# Altium schematic sheet MotorDriver.SchDoc
size A3
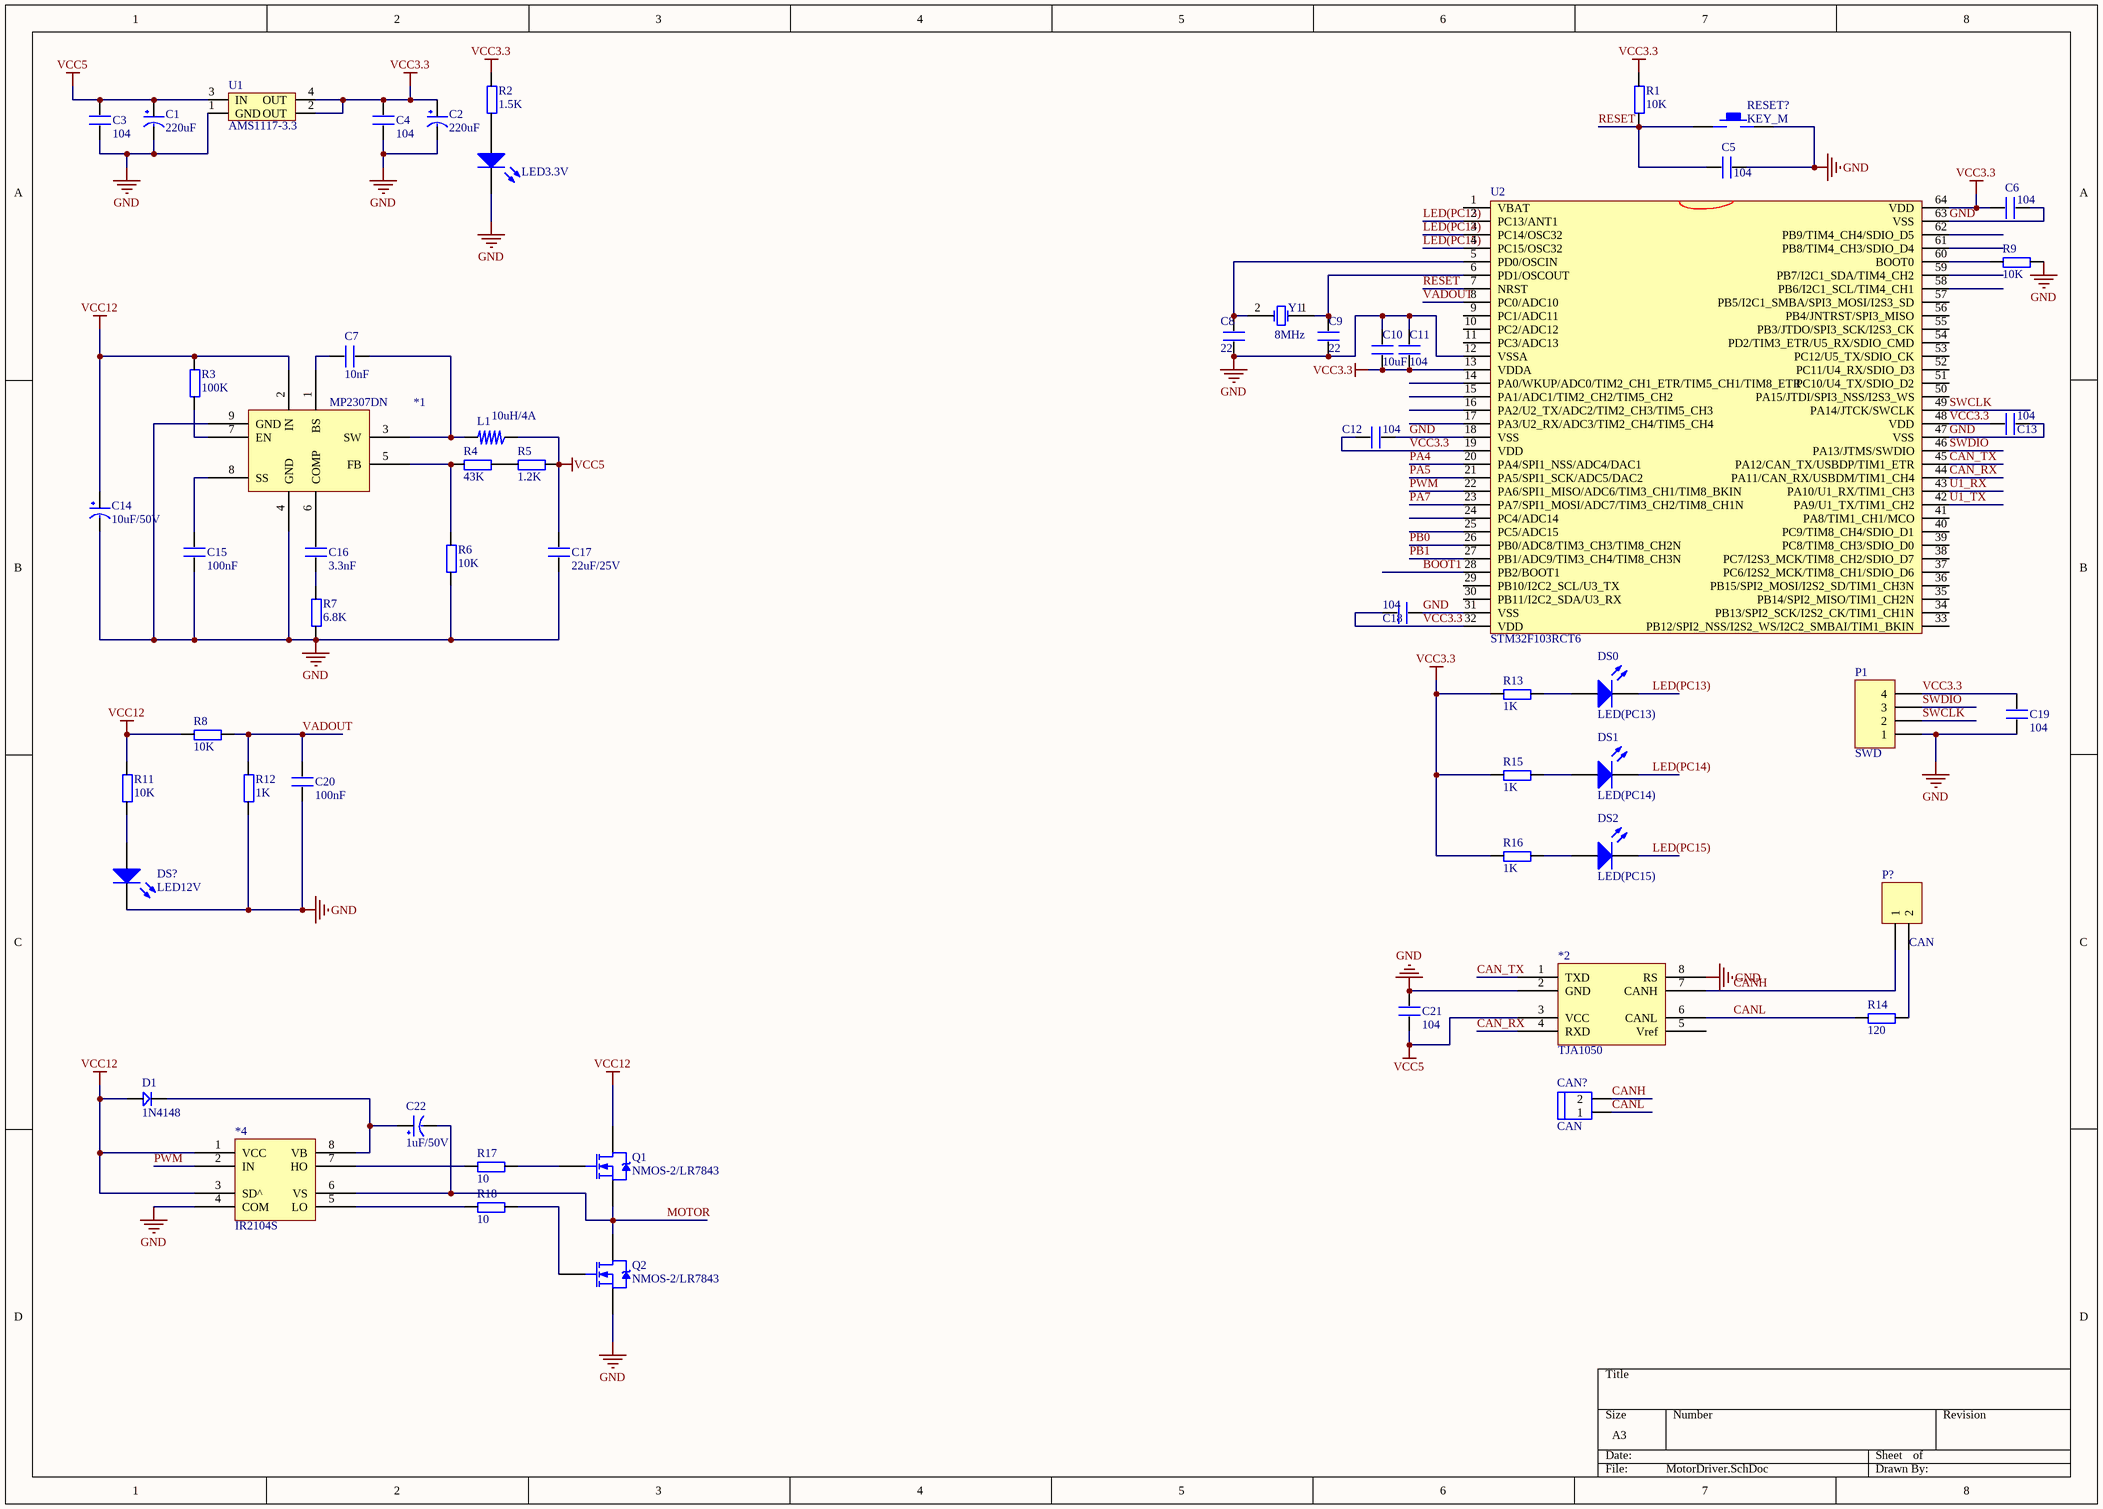
[diagram p0: MotorDriver.SchDoc]

## Parts
*1  MP2307DN  [SOP8]
*2  TJA1050  [SOP8]
*4  IR2104S  [SOP8]
C1  220uF  [CC6.56.5]
C2  220uF  [CC6.56.5]
C3  104  [0603P]
C4  104  [0603P]
C5  104  [0603P]
C6  104  [0603P]
C7  10nF  [0603P]
C8  22  [0603P]
C9  22  [0603P]
C10  10uF  [0603P]
C11  104  [0603P]
C12  104  [0603P]
C13  104  [0603P]
C14  10uF/50V  [CC6.56.5]
C15  100nF  [0603P]
C16  3.3nF  [0603P]
C17  22uF/25V  [0603P]
C18  104  [0603P]
C19  104  [0603P]
C20  100nF  [0603P]
C21  104  [0603P]
C22  1uF/50V  [CC6.56.5]
CAN?  CAN  [HEAD2L-0.8]
D1  1N4148  [DIODE_SOP]
DS0  LED(PC13)  [SMDLED]
DS1  LED(PC14)  [SMDLED]
DS2  LED(PC15)  [SMDLED]
DS?  LED12V  [SMDLED]
DS_source?  LED3.3V  [SMDLED]
L1  10uH/4A  [L_SOP74]
P1  SWD  [HDR1X4]
P?  CAN  [HDR1X2]
Q1  NMOS-2/LR7843  [SOP8]
Q2  NMOS-2/LR7843  [TO-220AB]
R1  10K  [0603P]
R2  1.5K  [0603P]
R3  100K  [0603P]
R4  43K  [0603P]
R5  1.2K  [0603P]
R6  10K  [0603P]
R7  6.8K  [0603P]
R8  10K  [0603P]
R9  10K  [0603P]
R11  10K  [0603P]
R12  1K  [0603P]
R13  1K  [0603P]
R14  120  [0603P]
R15  1K  [0603P]
R16  1K  [0603P]
R17  10  [0603P]
R18  10  [0603P]
RESET?  KEY_M  [KEY_M]
U1  AMS1117-3.3  [AMS1117]
U2  STM32F103RCT6  [STM-LQFP64_M]
Y1  8MHz  [XTAL_US]

## Nets
GND: *1.4(GND) *1.9(GND) *2.2(GND) *2.8(RS) *4.4(COM) C1.2(GND) C2.2(GND) C3.1 C4.1 C5.2 C6.2 C8.1 C9.1 C10.2 C11.2 C12.2 C13.2 C14.2(GND) C15.1 C17.1 C18.2 C19.1 C20.1 C21.2 DS?.2(K) DS_source?.2(K) P1.1 Q2.3(S) R6.1 R7.1 R9.2 R12.1 RESET?.2 U1.1(GND) U2.12(VSSA) U2.18(VSS) U2.31(VSS) U2.47(VSS) U2.63(VSS)
VCC3.3: C2.1(VCC) C4.2 C6.1 C10.1 C11.1 C12.1 C13.1 C18.1 C19.2 P1.4 R1.2 R2.2 R13.1 R15.1 R16.1 U1.2(OUT) U1.4(OUT) U2.13(VDDA) U2.19(VDD) U2.32(VDD) U2.48(VDD) U2.64(VDD)
VCC5: *2.3(VCC) C1.1(VCC) C3.2 C17.2 C21.1 L1.1 R5.2 U1.3(IN)
VCC12: *1.2(IN) *4.1(VCC) *4.3(SD^) C14.1(VCC) D1.1 Q1.2(D) R3.2 R8.1 R11.2
BOOT1: U2.28(PB2/BOOT1)
CAN_RX: *2.4(RXD) U2.44(PA11/CAN_RX/USBDM/TIM1_CH4)
CAN_TX: *2.1(TXD) U2.45(PA12/CAN_TX/USBDP/TIM1_ETR)
CANH: *2.7(CANH) CAN?.2 P?.1
CANL: *2.6(CANL) CAN?.1 R14.1
LED(PC13): DS0.2(K) U2.2(PC13/ANT1)
LED(PC14): DS1.2(K) U2.3(PC14/OSC32)
LED(PC15): DS2.2(K) U2.4(PC15/OSC32)
MOTOR: *4.6(VS) C22.2(GND) Q1.3(S) Q2.2(D)
PA4: U2.20(PA4/SPI1_NSS/ADC4/DAC1)
PA5: U2.21(PA5/SPI1_SCK/ADC5/DAC2)
PA7: U2.23(PA7/SPI1_MOSI/ADC7/TIM3_CH2/TIM8_CH1N)
PB0: U2.26(PB0/ADC8/TIM3_CH3/TIM8_CH2N)
PB1: U2.27(PB1/ADC9/TIM3_CH4/TIM8_CH3N)
PWM: *4.2(IN) U2.22(PA6/SPI1_MISO/ADC6/TIM3_CH1/TIM8_BKIN)
RESET: C5.1 R1.1 RESET?.1 U2.7(NRST)
SWCLK: P1.2 U2.49(PA14/JTCK/SWCLK)
SWDIO: P1.3 U2.46(PA13/JTMS/SWDIO)
U1_RX: U2.43(PA10/U1_RX/TIM1_CH3)
U1_TX: U2.42(PA9/U1_TX/TIM1_CH2)
VADOUT: C20.2 R8.2 R12.2 U2.8(PC0/ADC10)
Net*1_1: *1.1(BS) C7.1
Net*1_3: *1.3(SW) C7.2 L1.2
Net*1_5: *1.5(FB) R4.1 R6.2
Net*1_6: *1.6(COMP) C16.2
Net*1_7: *1.7(EN) R3.1
Net*1_8: *1.8(SS) C15.2
Net*4_5: *4.5(LO) R18.1
Net*4_7: *4.7(HO) R17.1
Net*4_8: *4.8(VB) C22.1(VCC) D1.2
NetC8_2: C8.2 U2.5(PD0/OSCIN) Y1.2(OSC2)
NetC9_2: C9.2 U2.6(PD1/OSCOUT) Y1.1(OSC1)
NetC16_1: C16.1 R7.2
NetDS0_1: DS0.1(A) R13.2
NetDS1_1: DS1.1(A) R15.2
NetDS2_1: DS2.1(A) R16.2
NetDS?_1: DS?.1(A) R11.1
NetDS_source?_1: DS_source?.1(A) R2.1
NetP?_2: P?.2 R14.2
NetQ1_1: Q1.1(G) R17.2
NetQ2_1: Q2.1(G) R18.2
NetR4_2: R4.2 R5.1
NetR9_1: R9.1 U2.60(BOOT0)

Not connected (* = marked no-connect by the designer): *2 5(Vref); U2 1(VBAT) 9(PC1/ADC11) 10(PC2/ADC12) 11(PC3/ADC13) 14(PA0/WKUP/ADC0/TIM2_CH1_ETR/TIM5_CH1/TIM8_ETR) 15(PA1/ADC1/TIM2_CH2/TIM5_CH2) 16(PA2/U2_TX/ADC2/TIM2_CH3/TIM5_CH3) 17(PA3/U2_RX/ADC3/TIM2_CH4/TIM5_CH4) 24(PC4/ADC14) 25(PC5/ADC15) 29(PB10/I2C2_SCL/U3_TX) 30(PB11/I2C2_SDA/U3_RX) 33(PB12/SPI2_NSS/I2S2_WS/I2C2_SMBAI/TIM1_BKIN) 34(PB13/SPI2_SCK/I2S2_CK/TIM1_CH1N) 35(PB14/SPI2_MISO/TIM1_CH2N) 36(PB15/SPI2_MOSI/I2S2_SD/TIM1_CH3N) 37(PC6/I2S2_MCK/TIM8_CH1/SDIO_D6) 38(PC7/I2S3_MCK/TIM8_CH2/SDIO_D7) 39(PC8/TIM8_CH3/SDIO_D0) 40(PC9/TIM8_CH4/SDIO_D1) 41(PA8/TIM1_CH1/MCO) 50(PA15/JTDI/SPI3_NSS/I2S3_WS) 51(PC10/U4_TX/SDIO_D2) 52(PC11/U4_RX/SDIO_D3) 53(PC12/U5_TX/SDIO_CK) 54(PD2/TIM3_ETR/U5_RX/SDIO_CMD) 55(PB3/JTDO/SPI3_SCK/I2S3_CK) 56(PB4/JNTRST/SPI3_MISO) 57(PB5/I2C1_SMBA/SPI3_MOSI/I2S3_SD) 58(PB6/I2C1_SCL/TIM4_CH1) 59(PB7/I2C1_SDA/TIM4_CH2) 61(PB8/TIM4_CH3/SDIO_D4) 62(PB9/TIM4_CH4/SDIO_D5)

## Library data of the parts
C1 C2 C14 C22 = CAP
C3-C13 C15-C21 = C
CAN? = HEAD2
D1 = D
DS0-DS2 DS? DS_source? = LED2: Typical RED, GREEN, YELLOW, AMBER GaAs LED; Published: 8-Jun-2000; LatestRevisionDate: 17-Jul-2002; LatestRevisionNote: Re-released for DXP Platform.; PackageDocument: Feb-2002; PackageReference: 3.2X1.6X1.1; Publisher: Altium Limited
L1 = L_SOP
P1 = Header 4: Header, 4-Pin; LatestRevisionDate: 17-Jul-2002; LatestRevisionNote: Re-released for DXP Platform.; Publisher: Altium Limited
P? = Header 2: Header, 2-Pin; LatestRevisionDate: 17-Jul-2002; LatestRevisionNote: Re-released for DXP Platform.; Publisher: Altium Limited
Q1 Q2 = NMOS-2: N-Channel Power MOSFET; Note: Pin 2 is electrically connected to pin 4.; Published: 8-Jun-2000; LatestRevisionDate: 17-Jul-2002; LatestRevisionNote: Re-released for DXP Platform.; DatasheetVersion: PD-9.814; PackageVersion: Feb-1997; PackageReference: TO-220AB; Publisher: Altium Limited; PackageDescription: TO, Thru-Hole, Vertical, Heatsink Mounted; 3 In-Line Leads; Pitch 2.54 mm; ComponentLink1Description: Manufacturer Link; ComponentLink1URL: http://www.irf.com/
R1-R9 R11-R18 = R
U1 = AMS1117
U2 = STM32F103RDT6
Y1 = XTAL: Crystal Oscillator; Published: 8-Jun-2000; LatestRevisionDate: 17-Jul-2002; LatestRevisionNote: Re-released for DXP Platform.; Publisher: Altium Limited